# EasyEDA Pro project ProPrj_SRC_Robot2025_V1.0_2026-09-06.epro, schematic Schematic-POWBRD
Board Name: Power_Board; Create Date: 2025-11-13; Page Name: P1; Project Name: SRC_Robot2025_V1.0; Schematic Name: Schematic-POWBRD; Update Date: 2025-11-13; Company: 嘉立创EDA; Page Size: A4; Version: V1.0
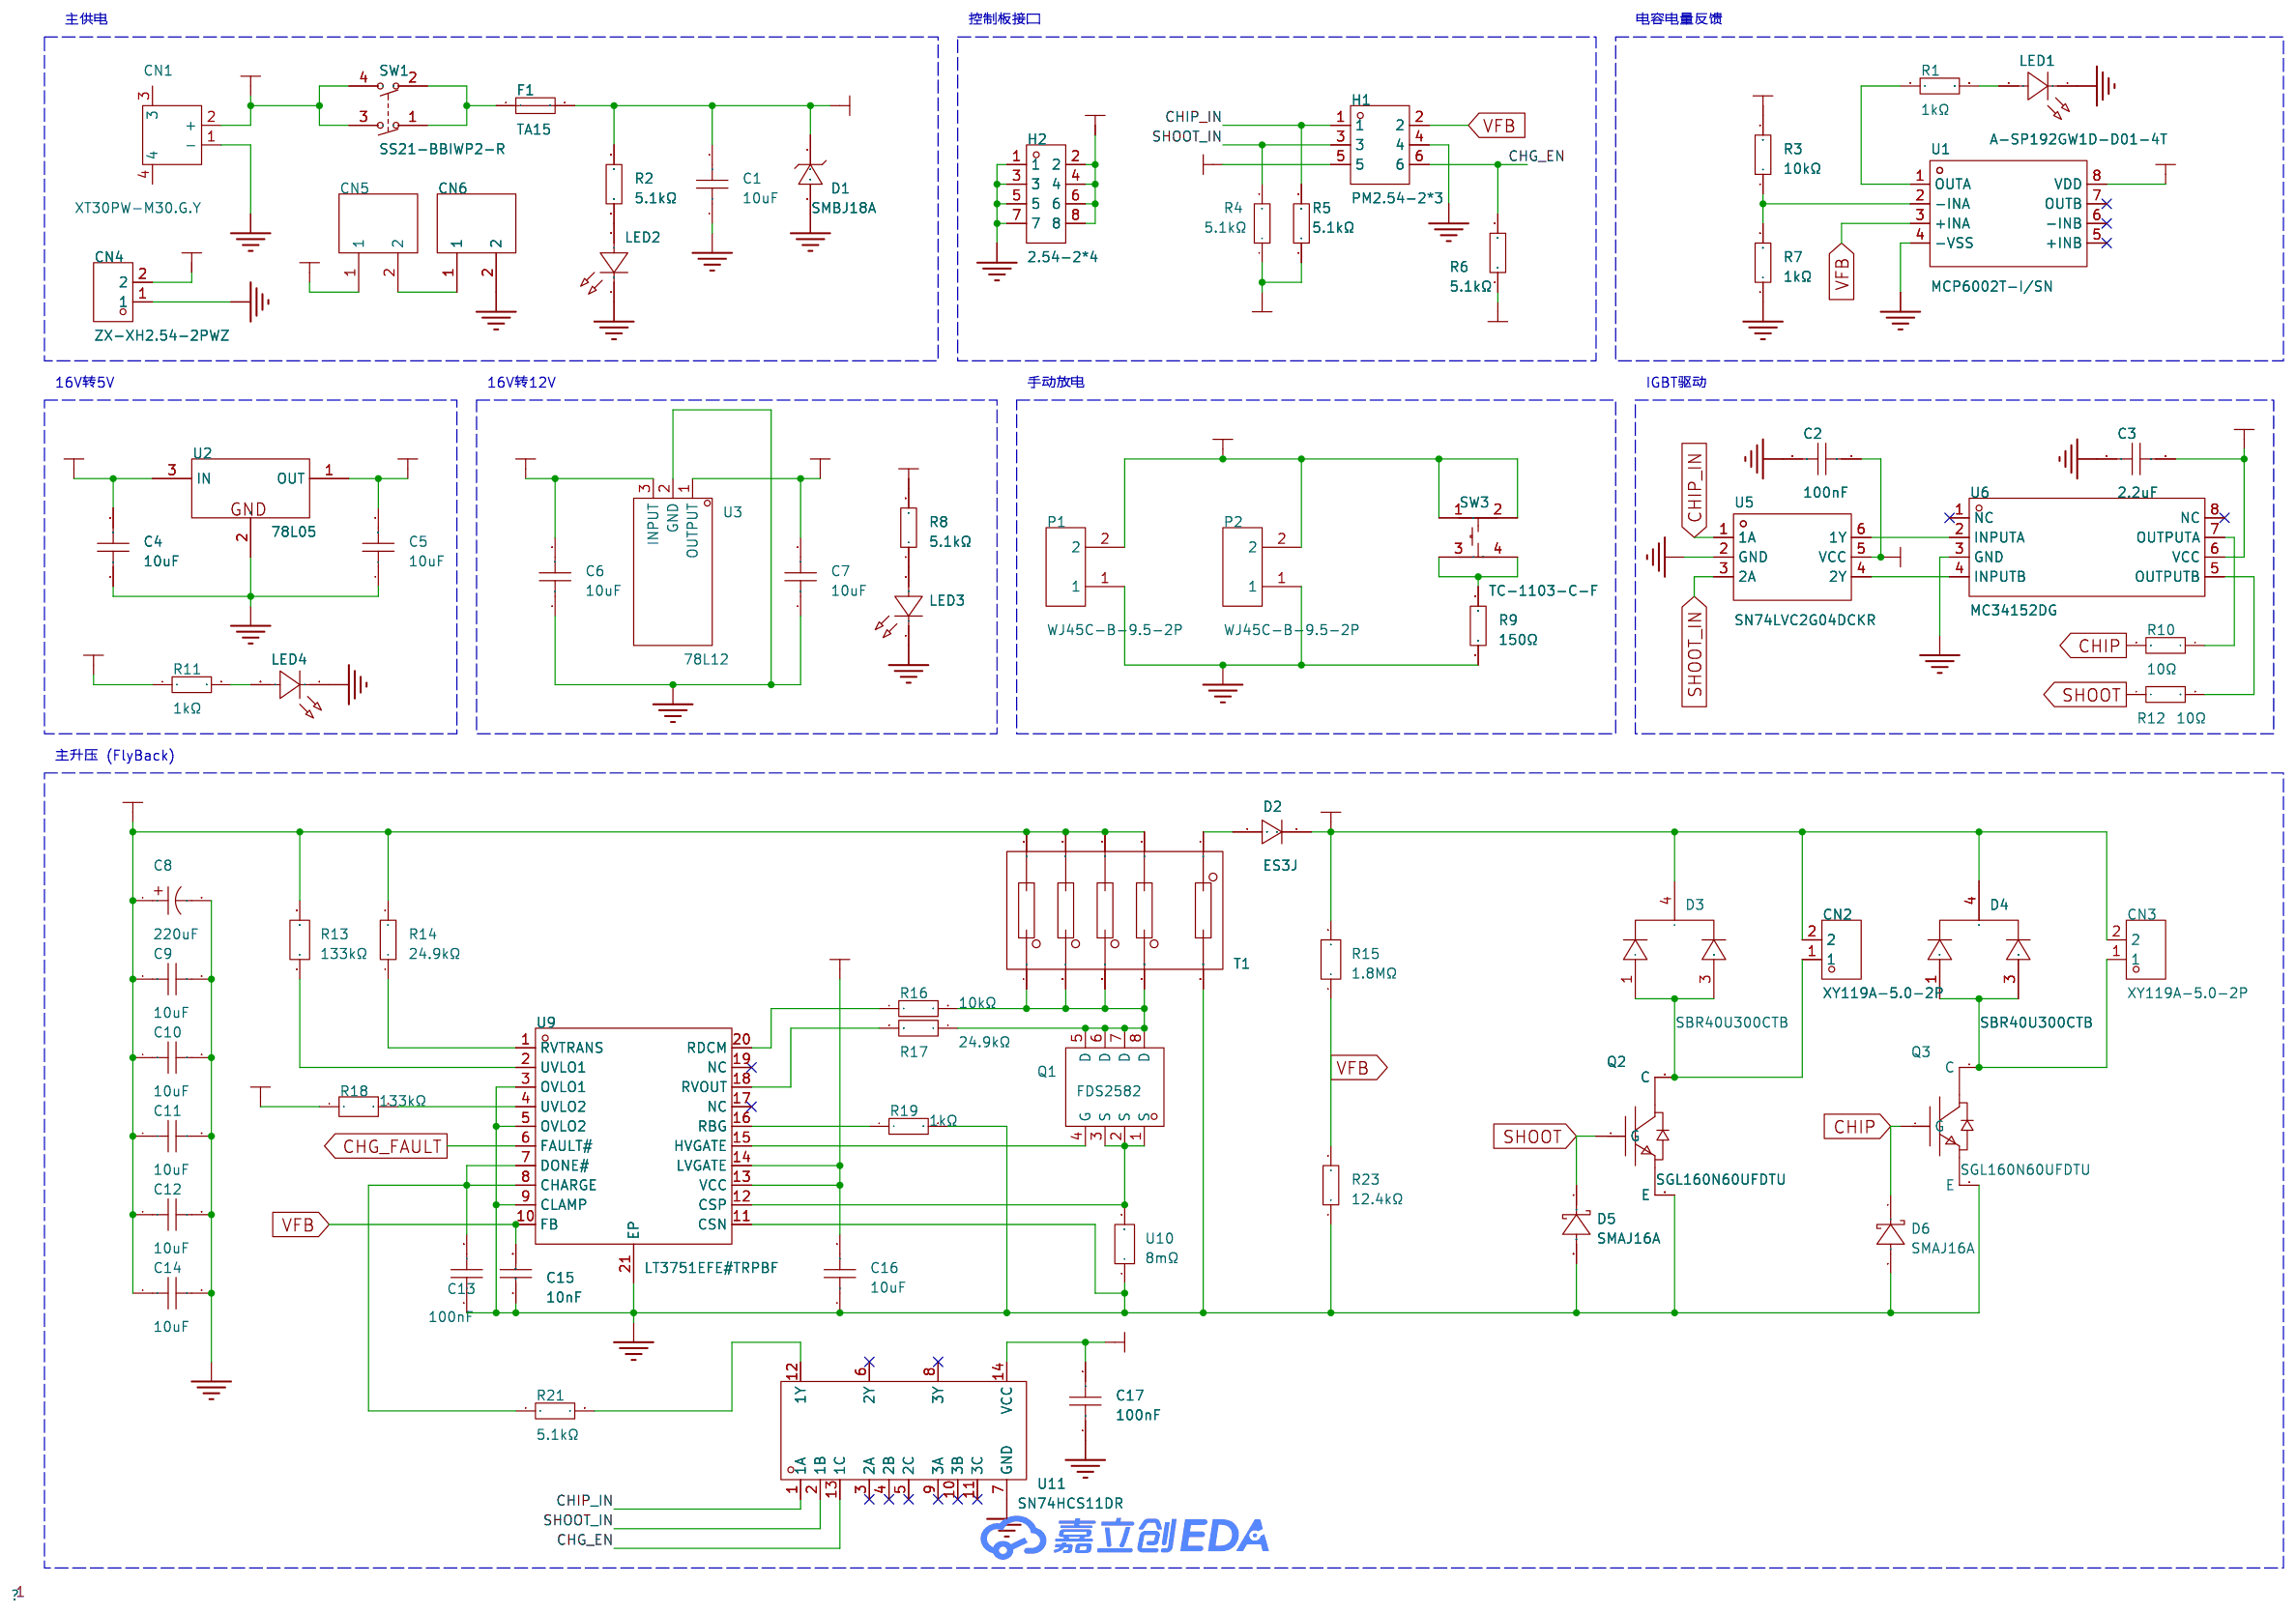
[diagram p10: schematic sheet]

## Parts
C1  10uF  [C0805]
C2  100nF  [C0603]
C3  2.2uF  [C0603]
C4  10uF  [C0805]
C5  10uF  [C0805]
C6  10uF  [C0805]
C7  10uF  [C0805]
C8  220uF  [CAP-SMD_BD6.3-L6.6-W6.6-LS7.4-FD]
C9  10uF  [C1210]
C10  10uF  [C1210]
C11  10uF  [C1210]
C12  10uF  [C1210]
C13  100nF  [C0603]
C14  10uF  [C1210]
C15  10nF  [C0603]
C16  10uF  [C0603]
C17  100nF  [C0603]
CN1  XT30PW-M30.G.Y  [CONN-TH_XT30PW-M]
CN2  XY119A-5.0-2P  [CONN-TH_XY119A-5.0-2P]
CN3  XY119A-5.0-2P  [CONN-TH_XY119A-5.0-2P]
CN4  ZX-XH2.54-2PWZ  [CONN-TH_2P-P2.50_ZX-XH2.54-2PWZ]
CN5  AM-1015B-M  [CONN-TH_AM-1015B-M]
CN6  AM-1015B-M  [CONN-TH_AM-1015B-M]
D1  SMBJ18A  [SMB_L4.4-W3.6-LS5.3-RD]
D2  ES3J  [SMC_L6.9-W5.9-LS7.9-RD]
D3  SBR40U300CTB  [D2PAK_L9.1-W10.0-P2.54-LS15.3-BR]
D4  SBR40U300CTB  [D2PAK_L9.1-W10.0-P2.54-LS15.3-BR]
D5  SMAJ16A  [SMA_L4.3-W2.6-LS5.0-RD]
D6  SMAJ16A  [SMA_L4.3-W2.6-LS5.0-RD]
F1  TA15  [F2410]
H1  PM2.54-2*3  [HDR-TH_6P-P2.54-V-F-R2-C3-S2.54]
H2  2.54-2*4  [HDR-TH_8P-P2.54-V-F-R2-C4-S2.54]
LED1  A-SP192GW1D-D01-4T  [LED0603-RD]
LED2  A-SP192GW1D-D01-4T  [LED0603-RD]
LED3  A-SP192GW1D-D01-4T  [LED0603-RD]
LED4  A-SP192GW1D-D01-4T  [LED0603-RD]
P1  WJ45C-B-9.5-2P  [CONN-TH_2P-P9.50_WJ45C-B-2P]
P2  WJ45C-B-9.5-2P  [CONN-TH_2P-P9.50_WJ45C-B-2P]
Q1  FDS2582  [SO-8_L4.9-W3.9-P1.27-LS6.0-BL]
Q2  SGL160N60UFDTU  [TO-264-3_L20.0-W5.0-P5.45-L]
Q3  SGL160N60UFDTU  [TO-264-3_L20.0-W5.0-P5.45-L]
R1  1kΩ  [R0603]
R2  5.1kΩ  [R0603]
R3  10kΩ  [R0603]
R4  5.1kΩ  [R0805]
R5  5.1kΩ  [R0805]
R6  5.1kΩ  [R0805]
R7  1kΩ  [R0603]
R8  5.1kΩ  [R0603]
R9  150Ω  [RES-TH_BD9.5-L22.0-P26.00-D0.7]
R10  10Ω  [R0603]
R11  1kΩ  [R0603]
R12  10Ω  [R0603]
R13  133kΩ  [R0603]
R14  24.9kΩ  [R0603]
R15  1.8MΩ  [R1210]
R16  10kΩ  [R0603]
R17  24.9kΩ  [R0603]
R18  133kΩ  [R0603]
R19  1kΩ  [R0603]
R21  5.1kΩ  [R0603]
R23  12.4kΩ  [R0603]
SW1  SS21-BBIWP2-R  [SW-TH_SS21-BBIWP2]
SW3  TC-1103-C-F  [SW-TH_4P-L12.0-W12.0-P5.00-LS12.5]
T1  -  [DA2034-AL]
U1  MCP6002T-I/SN  [SOIC-8_L4.9-W3.9-P1.27-LS6.0-BL]
U2  78L05  [SOT-89-3_L4.5-W2.5-P1.50-LS4.2-BR]
U3  78L12  [SOT-89-3_L4.5-W2.5-P1.50-LS4.2-BR]
U5  SN74LVC2G04DCKR  [SOT-363_L2.0-W1.3-P0.65-LS2.1-BR]
U6  MC34152DG  [SOIC-8_L5.0-W4.0-P1.27-LS6.0-BL]
U9  LT3751EFE#TRPBF  [TSSOP-20_L6.5-W4.4-P0.65-LS6.4-BL-EP-3]
U10  8mΩ  [R1206]
U11  SN74HCS11DR  [SOIC-14_L8.6-W3.9-P1.27-LS6.0-BL]

## Library data of the parts
C1 C4-C7 = CL21A106KAYNNNE_C15850: 容值:10uF;精度:±10%;额定电压:25V;材质(温度系数):X5R;; LCSC Part Name: 10uF ±10% 25V; Supplier Part: C15850; Manufacturer: SAMSUNG(三星); Manufacturer Part: CL21A106KAYNNNE; Supplier Footprint: 0805; JLCPCB Part Class: 基础库; Datasheet: https://atta.szlcsc.com/upload/public/pdf/source/20160218/1457707763339.pdf; Supplier: LCSC; Tolerance: ±10%; Voltage Rated: 25V; Temperature Coefficient: X5R
C2 C13 C17 = CGA0603X7R104K500JT: 容值:100nF;精度:±10%;额定电压:50V;材质(温度系数):X7R;; LCSC Part Name: 100nF ±10% 50V; Supplier Part: C6119867; Manufacturer: HRE(芯声); Supplier Footprint: 0603; JLCPCB Part Class: 扩展库; Supplier: LCSC; Tolerance: ±10%; Voltage Rated: 50V; Temperature Coefficient: X7R
C3 = CL10A225KB8NNNC: 容值:2.2uF;精度:±10%;额定电压:50V;材质(温度系数):X5R;; LCSC Part Name: 2.2uF ±10% 50V; Supplier Part: C913904; Manufacturer: SAMSUNG(三星); Supplier Footprint: 0603; JLCPCB Part Class: 扩展库; Datasheet: https://atta.szlcsc.com/upload/public/pdf/source/20160218/1457707763339.pdf; Supplier: LCSC; Tolerance: ±10%; Voltage Rated: 50V; Temperature Coefficient: X5R
C8 = RVT1E221M0607: 容值:220uF;精度:±20%;额定电压:25V;纹波电流:150mA@120Hz;等效串联电阻:-;; LCSC Part Name: 220uF ±20% 25V; Supplier Part: C2918361; Manufacturer: ROQANG(容强); Supplier Footprint: SMD,D6.3xL7.7mm; JLCPCB Part Class: 扩展库; Datasheet: https://atta.szlcsc.com/upload/public/pdf/source/20211118/497C0614266278696CA52BDF245B991F.pdf; Supplier: LCSC; Tolerance: ±20%; Rated Voltage: 25V; Ripple Current: 150mA@120Hz; φD: 6.3mm; L: 7.7mm; Lifetime @ Temp: 2000hrs@105℃; Operating Temperature: -40℃~+105℃
C9-C12 C14 = FS32X106K101EGG: 容值:10uF;精度:±10%;额定电压:100V;材质(温度系数):X7R;; LCSC Part Name: 10uF ±10% 100V; Supplier Part: C5156756; Manufacturer: PSA(信昌电陶); Supplier Footprint: 1210; JLCPCB Part Class: 扩展库; Datasheet: https://atta.szlcsc.com/upload/public/pdf/source/20220906/2A42A90825742552985FFB5A7BAB200E.pdf; Supplier: LCSC; Tolerance: ±10%; Voltage Rated: 100V; Temperature Coefficient: X7R
C15 = CC0603KRX7R9BB103: 容值:10nF;精度:±10%;额定电压:50V;材质(温度系数):X7R;; LCSC Part Name: 10nF ±10% 50V; Supplier Part: C100042; Manufacturer: YAGEO(国巨); Supplier Footprint: 0603; JLCPCB Part Class: 扩展库; Datasheet: https://atta.szlcsc.com/upload/public/pdf/source/20181008/C309510_22F155564471FAF6A489F7D68F34234E.pdf; Supplier: LCSC; Tolerance: ±10%; Voltage Rated: 50V; Temperature Coefficient: X7R
C16 = CGA0603X5R106K100JT: 容值:10uF;精度:±10%;额定电压:10V;材质(温度系数):X5R;; LCSC Part Name: 10uF ±10% 10V; Supplier Part: C6119842; Manufacturer: HRE(芯声); Supplier Footprint: 0603; JLCPCB Part Class: 扩展库; Supplier: LCSC; Tolerance: ±10%; Voltage Rated: 10V; Temperature Coefficient: X5R
CN1 = XT30PW-M30.G.Y: 类别:-;类型1:-;; LCSC Part Name: AMASS(艾迈斯)航模插头 卧式弯脚 XT30PW-M公头; Supplier Part: C431092; Manufacturer: AMASS(艾迈斯); JLCPCB Part Class: 扩展库; Datasheet: https://atta.szlcsc.com/upload/public/pdf/source/20220222/6A9F22F7850E25B33E1BE430ADF8560B.pdf; Supplier: LCSC; Type: 航模插头; RatedVoltage: DC 500V; InterfaceType: 公头; RatedCurrent: 15A; RecommendedWireGauge: 16/18/20AWG; contact resistance: 1.2mΩ; specifications: 2pin
CN2 CN3 = XY119A-5.0-2P: 结构:1x2P;间距:5mm;颜色:灰色;安装类型:-;总PIN数:2P;每排PIN数:2;额定电流:5A;额定电压:300V;线规 - AWG:18~20;线规 - 平方毫米:1.5;工作温度范围:-;排数:1;; LCSC Part Name: 1x2P 5mm 每排P数:2 排数:1; Supplier Part: C784939; Manufacturer: XINLAIYA(新莱亚); Supplier Footprint: 插件,P=5mm; JLCPCB Part Class: 扩展库; Datasheet: https://atta.szlcsc.com/upload/public/pdf/source/20200917/C784939_AFEB00D015492A69142AB4BCD44AD19C.pdf; Supplier: LCSC; Structure: 1x2P; Pitch: 5mm; Color: 灰色; Number of Pins: 2P; Number of PINs Per Row: 2; Current Rating (Max): 5A; Voltage Rating (Max): 300V; Wire Gauge - AWG: 18~20; Wire Gauge - mm2: 1.5; Number of Rows: 1
CN4 = ZX-XH2.54-2PWZ: 插针结构:1x2P;间距:2.5mm;安装方式:弯插;参考系列:XH;总PIN数:2P;排数:1;每排PIN数:2;行距:-;额定电流:3A;触头材质:黄铜;触头镀层:锡;工作温度范围:-25℃~+85℃;; LCSC Part Name: 1x2P 间距:2.5mm 弯插 系列:XH; Supplier Part: C7429641; Manufacturer: Megastar(兆星); Supplier Footprint: 弯插,P=2.5mm; JLCPCB Part Class: 扩展库; Datasheet: https://atta.szlcsc.com/upload/public/pdf/source/20230619/56AE8F2E01CDFEAA97FC89B5ED558AB5.pdf; Supplier: LCSC; Pins Structure: 1x2P; Pitch: 2.5mm; Mounting Type: 弯插; Reference Series: XH; Number of Pins: 2P; Number of Rows: 1; Number of PINs Per Row: 2; Rated Current: 3A; Contact Material: 黄铜; Contact Plating: 锡; Operating Temperature: -25℃~+85℃; Rated Voltage (Max): 250V; Plastic Material: PA66; Flame Retardant Rating: UL94V-0; Color: 白色; Z-Height of the Board: 5.9mm; X-Length of Bottom Edge on Board (Spacing Line): 7.5mm; Y-Width of Bottom Edge on Board: 7.32mm
CN5 CN6 = AM-1015B-M: 类别:-;类型1:-;; LCSC Part Name: AMASS(艾迈斯)电源连接器公头AM-1015B-M; Supplier Part: C90631; Manufacturer: AMASS(艾迈斯); JLCPCB Part Class: 扩展库; Datasheet: https://atta.szlcsc.com/upload/public/pdf/source/20161217/1481939174683.pdf; Supplier: LCSC; Brand: 艾迈斯; Type: T行插头; RatedVoltage: DC 500V; InterfaceType: 双公头; MetalMaterial: 铜镀金; InsulationMaterial: PA; RatedCurrent: 25A; RecommendedWireGauge: 12AWG; FlameRetardantGrade: UL94 V0; contact resistance: 0.45mΩ
D1 = SMBJ18A_C726827: 极性：单向 反向截止电压(Vrwm)：18V 击穿电压：20V 最大钳位电压：29.2V; Supplier Part: C726827; Manufacturer: TWGMC(台湾迪嘉); Supplier Footprint: SMB; JLCPCB Part Class: 扩展库; Datasheet: https://atta.szlcsc.com/upload/public/pdf/source/20200901/C726811_07201DC3516E92FF13903A0BAE18F725.pdf; Supplier: LCSC
D2 = ES3J_C241736: 二极管配置:-;正向压降(Vf):1.7V@3A;直流反向耐压(Vr):600V;平均整流电流(Io):3A;; LCSC Part Name: 电压:600V 电流:3A; Supplier Part: C241736; Manufacturer: onsemi(安森美); Supplier Footprint: SMC(DO-214AB); JLCPCB Part Class: 扩展库; Datasheet: https://atta.szlcsc.com/upload/public/pdf/source/20181011/C241736_92143A5DE005FA7AD96EC325CCC50FD0.pdf; Supplier: LCSC; Forward Voltage (Vf@If): 1.7V@3A; Reverse Voltage (Vr): 600V; Average Rectified Current (Io): 3A; Reverse Leakage Current: 10uA@600V
D3 D4 = SBR40U300CTB: 二极管配置:1对共阴极;正向压降(Vf):870mV@20A;直流反向耐压(Vr):300V;整流电流:20A;; LCSC Part Name: 电压:300V 电流:20A; Supplier Part: C443663; Manufacturer: DIODES(美台); Supplier Footprint: D2PAK; JLCPCB Part Class: 扩展库; Datasheet: https://atta.szlcsc.com/upload/public/pdf/source/20191127/C460254_D77CF0DA5F9C5BCD250C1885B666AA89.pdf; Supplier: LCSC; Diode Configuration: 1对共阴极; Forward Voltage (Vf) @ If: 870mV@20A; Reverse Voltage (Vr): 300V; Rectified Current: 20A; Reverse Leakage Current: 100uA@300V
D5 D6 = SMAJ16A_C908770: 反向截止电压(Vrwm):16V;最大钳位电压:26V;峰值脉冲电流(Ipp)@10/1000us:15.3A;击穿电压:17.8V;; LCSC Part Name: 单向TVS 16V截止 15.3A峰值脉冲; Supplier Part: C908770; Manufacturer: GOODWORK(固得沃克); Supplier Footprint: SMA(DO-214AC); JLCPCB Part Class: 扩展库; Datasheet: https://atta.szlcsc.com/upload/public/pdf/source/20201231/C908757_5436EAF671B686EFC2F0DD2098F0ED89.pdf; Supplier: LCSC; Reverse Stand-Off Voltage (Vrwm): 16V; Maximum Clamping Voltage: 26V; Peak Pulse Current (Ipp)@10/1000us: 15.3A; Breakdown Voltage: 17.8V; Reverse Leakage Current (Ir): 5uA; Type: TVS
F1 = TA15: LCSC Part Name: 2410慢断 15A 125V 镀金; Supplier Part: C3014141; Manufacturer: TLC(竞沃); Supplier Footprint: 2410; JLCPCB Part Class: 扩展库; Datasheet: https://atta.szlcsc.com/upload/public/pdf/source/20220520/C6351CD6C5E279D329958371DE6E5323.pdf; Supplier: LCSC
H1 = PM2.54-2*3: 插孔结构:2x3P;间距:2.54mm;行距:2.54mm;圆孔/方孔:方孔;安装类型:直插;排数:双排;总孔位数:6P;额定电流:2.5A;插孔方向:顶部;塑高:8.5mm;工作温度范围:-40℃~+105℃;; LCSC Part Name: 间距:2.54mm 2x3P 直插; Supplier Part: C5116527; Manufacturer: ZHOURI(洲日); Supplier Footprint: 插件,P=2.54mm; JLCPCB Part Class: 扩展库; Datasheet: https://atta.szlcsc.com/upload/public/pdf/source/20220729/B685A447B6E7D9EA1A3EF6B07540DD20.pdf; Supplier: LCSC; Holes Structure: 2x3P; Pitch: 2.54mm; Row Spacing: 2.54mm; Circular Hole / Square Hole: 方孔; Mounting Type: 直插; Number of Rows: 双排; Number of Holes: 6P; Current Rating (Max): 2.5A; Holes Direction: 顶部; Insulation Height: 8.5mm; Operating Temperature Range: -40℃~+105℃
H2 = 2.54-2*4: 插孔结构:2x4P;间距:2.54mm;行距:2.54mm;圆孔/方孔:方孔;安装类型:直插;排数:双排;总孔位数:8P;额定电流:2.5A;额定电压:-;插孔方向:顶部;塑高:8.5mm;工作温度范围:-40℃~+105℃;; LCSC Part Name: 间距:2.54mm 2x4P 直插; Supplier Part: C2977588; Manufacturer: ZHOURI(洲日); Supplier Footprint: 插件,P=2.54mm; JLCPCB Part Class: 扩展库; Datasheet: https://atta.szlcsc.com/upload/public/pdf/source/20220328/363EB391BC0EB759CF231FC910753CBE.pdf; Supplier: LCSC; Holes Structure: 2x4P; Pitch: 2.54mm; Row Spacing: 2.54mm; Circular Hole / Square Hole: 方孔; Mounting Type: 直插; Number of Rows: 双排; Number of Holes: 8P; Current Rating (Max): 2.5A; Holes Direction: 顶部; Insulation Height: 8.5mm; Operating Temperature Range: -40℃~+105℃
LED1-LED4 = A-SP192GW1D-D01-4T: 发光颜色:白色;正向压降(Vf):2.5V~2.9V;功率:95mW;透镜颜色:-;发光强度:57mcd~225mcd;发光角度:130°;载带方式:正贴;工作温度:-40℃~+85℃;; LCSC Part Name: 0603白光正贴（正白偏冷）; Supplier Part: C19171285; Manufacturer: Amicc(欧密格光电); Supplier Footprint: 0603; JLCPCB Part Class: 扩展库; Datasheet: https://atta.szlcsc.com/upload/public/pdf/source/20231108/C509B7BEC9EA0B1CC79F1E6D714E882A.pdf; Supplier: LCSC; Illumination Color: 白色; Voltage - Forward(Vf): 2.5V~2.9V; Power(Watts): 95mW; Luminous Intensity: 57mcd~225mcd; Viewing Angle: 130°; Mounting Sytle: 正贴; Operating Temperature: -40℃~+85℃
P1 P2 = WJ45C-B-9.5-2P: 隔板类型:两面;间距:9.5mm;结构:1x2P;安装方式:直针;引脚位置:中脚;排数:1;额定电流:32A;额定电压:750V;线规 - AWG:12~22;线规 - 平方毫米:4;工作温度范围:-40℃~+105℃;颜色:黑色;每排PIN数:2;; LCSC Part Name: 9.5mm 1x2P 每排P数:2 排数:1 直针 中脚; Supplier Part: C8397; Manufacturer: KANGNEX(康奈克斯电气); Supplier Footprint: 插件,P=9.5mm; JLCPCB Part Class: 扩展库; Datasheet: https://atta.szlcsc.com/upload/public/pdf/source/20191225/C8397_C0B2C2E73138A510EBF0F13B91F71912.pdf; Supplier: LCSC; Barrier Type: 两面; Pitch: 9.5mm; Structure: 1x2P; Mounting Style: 直针; Pin Location: 中脚; Number of Pins: 2P; Number of Rows: 1; Current Rating (Max): 32A; Voltage Rating (Max): 750V; Wire Gauge - AWG: 12~22; Wire Gauge - mm2: 4; Operating Temperature Range: -40℃~+105℃; Color: 黑色; Number of PINs Per Row: 2
Q1 = FDS2582: 类型:1个N沟道;漏源电压(Vdss):150V;连续漏极电流(Id):4.1A;导通电阻(RDS(on)@Vgs,Id):66mΩ@10V,4.1A;功率(Pd):2.5W;阈值电压(Vgs(th)@Id):2V@250uA;; LCSC Part Name: 1个N沟道 耐压:150V 电流:4.1A; Supplier Part: C455164; Manufacturer: onsemi(安森美); Supplier Footprint: SOIC-8; JLCPCB Part Class: 扩展库; Datasheet: https://atta.szlcsc.com/upload/public/pdf/source/20221020/9C50A917A0E5BABEC1E9E5186C957306.pdf; Supplier: LCSC; Type: 1个N沟道; Drain Source Voltage (Vdss): 150V; Continuous Drain Current (Id): 4.1A; Drain Source On Resistance (RDS(on)@Vgs,Id): 66mΩ@10V,4.1A; Power Dissipation (Pd): 2.5W; Gate Threshold Voltage (Vgs(th)@Id): 2V@250uA; Total Gate Charge (Qg@Vgs): 19nC@10V; Input Capacitance (Ciss@Vds): 1.29nF@25V; Reverse Transfer Capacitance (Crss@Vds): 32pF@25V; Operating Temperature: -55℃~+150℃
Q2 Q3 = SGL160N60UFDTU: IGBT类型:-;集射极击穿电压(Vces):600V;集电极电流(Ic):160A;功率(Pd):250W;; LCSC Part Name: 耐压:600V 电流:160A; Supplier Part: C11757; Manufacturer: onsemi(安森美); Supplier Footprint: TO-264-3; JLCPCB Part Class: 扩展库; Datasheet: https://atta.szlcsc.com/upload/public/pdf/source/20130302/1457706596740.pdf; Supplier: LCSC; Collector-Emitter Breakdown Voltage (Vces): 600V; Collector Current (Ic): 160A; Power Dissipation (Pd): 250W; Pulsed Collector Current (Icm): 300A; Gate-Emitter Threshold Voltage (Vge(th)@Ic): 2.6V@15V,80A; Total Gate Charge (Qg@Ic,Vge): 345nC; Turn?on Delay Time (Td(on)): 40ns; Turn?off Delay Time (Td(off)): 90ns; Turn?on Switching Loss (Eon): 2.5mJ; Turn?off Switching Loss (Eoff): 1.76mJ; Diode Reverse Recovery Time (Trr): 95ns; Operating Temperature: -55℃~+150℃@(Tj)
R1 R7 R11 R19 = 0603WAF1001T5E: 电阻类型:厚膜电阻;阻值:1kΩ;精度:±1%;功率:100mW;最大工作电压:75V;温度系数:±100ppm/℃;; LCSC Part Name: 1kΩ ±1% 100mW 厚膜电阻; Supplier Part: C21190; Manufacturer: UNI-ROYAL(厚声); Supplier Footprint: 0603; JLCPCB Part Class: 基础库; Datasheet: https://atta.szlcsc.com/upload/public/pdf/source/20200306/C422600_1E6D84923E4A46A82E41ADD87F860B5C.pdf; Supplier: LCSC; Type: 厚膜电阻; Tolerance: ±1%; Power(Watts): 100mW; Overload Voltage (Max): 75V; Temperature Coefficient: ±100ppm/℃; Operating Temperature Range: -55℃~+155℃
R2 R8 R21 = 0603WAF5101T5E: 电阻类型:厚膜电阻;阻值:5.1kΩ;精度:±1%;功率:100mW;最大工作电压:75V;温度系数:±100ppm/℃;; LCSC Part Name: 5.1kΩ ±1% 100mW 厚膜电阻; Supplier Part: C23186; Manufacturer: UNI-ROYAL(厚声); Supplier Footprint: 0603; JLCPCB Part Class: 基础库; Datasheet: https://atta.szlcsc.com/upload/public/pdf/source/20200306/C422600_1E6D84923E4A46A82E41ADD87F860B5C.pdf; Supplier: LCSC; Type: 厚膜电阻; Tolerance: ±1%; Power(Watts): 100mW; Overload Voltage (Max): 75V; Temperature Coefficient: ±100ppm/℃; Operating Temperature Range: -55℃~+155℃
R3 R16 = 0603WAF1002T5E: 电阻类型:厚膜电阻;阻值:10kΩ;精度:±1%;功率:100mW;最大工作电压:75V;温度系数:±100ppm/℃;; LCSC Part Name: 厚膜电阻 10kΩ ±1% 100mW; Supplier Part: C25804; Manufacturer: UNI-ROYAL(厚声); Supplier Footprint: 0603; JLCPCB Part Class: 基础库; Datasheet: https://atta.szlcsc.com/upload/public/pdf/source/20200306/C422600_1E6D84923E4A46A82E41ADD87F860B5C.pdf; Supplier: LCSC; Type: 厚膜电阻; Tolerance: ±1%; Power(Watts): 100mW; Overload Voltage (Max): 75V; Temperature Coefficient: ±100ppm/℃; Operating Temperature Range: -55℃~+155℃
R4-R6 = 0805W8F5101T5E: 电阻类型:厚膜电阻;阻值:5.1kΩ;精度:±1%;功率:125mW;最大工作电压:150V;温度系数:±100ppm/℃;; LCSC Part Name: 5.1kΩ ±1% 125mW 厚膜电阻; Supplier Part: C27834; Manufacturer: UNI-ROYAL(厚声); Supplier Footprint: 0805; JLCPCB Part Class: 基础库; Datasheet: https://atta.szlcsc.com/upload/public/pdf/source/20200306/C422600_1E6D84923E4A46A82E41ADD87F860B5C.pdf; Supplier: LCSC; Type: 厚膜电阻; Tolerance: ±1%; Power(Watts): 125mW; Overload Voltage (Max): 150V; Temperature Coefficient: ±100ppm/℃; Operating Temperature Range: -55℃~+155℃
R9 = CR-L5W-150Ω 5% P: 电阻类型:水泥电阻;阻值:150Ω;精度:±5%;功率:5W;温度系数:±350ppm/℃;; LCSC Part Name: 水泥电阻 150Ω ±5% 5W; Supplier Part: C334292; Manufacturer: CCO(千志电子); Supplier Footprint: 插件,22x9.5mm; JLCPCB Part Class: 扩展库; Datasheet: https://atta.szlcsc.com/upload/public/pdf/source/20191017/C437676_C54E3679BC570A0C77C1700A5DFC89CF.pdf; Supplier: LCSC; Type: 水泥电阻; Tolerance: ±5%; Overload Voltage (Max): 750V; Power(Watts): 5W; Temperature Coefficient: ±350ppm/℃; Operating Temperature Range: -55℃~+250℃
R10 R12 = 0603WAF100JT5E: 电阻类型:厚膜电阻;阻值:10Ω;精度:±1%;功率:100mW;最大工作电压:75V;温度系数:±400ppm/℃;; LCSC Part Name: 10Ω ±1% 100mW 厚膜电阻; Supplier Part: C22859; Manufacturer: UNI-ROYAL(厚声); Supplier Footprint: 0603; JLCPCB Part Class: 基础库; Datasheet: https://atta.szlcsc.com/upload/public/pdf/source/20200306/C422600_1E6D84923E4A46A82E41ADD87F860B5C.pdf; Supplier: LCSC; Type: 厚膜电阻; Tolerance: ±1%; Power(Watts): 100mW; Overload Voltage (Max): 75V; Temperature Coefficient: ±400ppm/℃; Operating Temperature Range: -55℃~+155℃
R13 R18 = RT0603BRE07133KL: 电阻类型:薄膜电阻;阻值:133kΩ;精度:±0.1%;功率:100mW;温度系数:±50ppm/℃;; LCSC Part Name: 薄膜电阻 133kΩ ±0.1% 100mW; Supplier Part: C861659; Manufacturer: YAGEO(国巨); Supplier Footprint: 0603; JLCPCB Part Class: 扩展库; Datasheet: https://atta.szlcsc.com/upload/public/pdf/source/20200610/C326738_5639A9F1B6EB6E4AE2197577D3456E7F.pdf; Supplier: LCSC; Type: 薄膜电阻; Tolerance: ±0.1%; Power(Watts): 100mW; Temperature Coefficient: ±50ppm/℃; Operating Temperature Range: -55℃~+155℃
R14 R17 = 0603WAF2492T5E: 电阻类型:厚膜电阻;阻值:24.9kΩ;精度:±1%;功率:100mW;最大工作电压:75V;温度系数:±100ppm/℃;; LCSC Part Name: 24.9kΩ ±1% 100mW 厚膜电阻; Supplier Part: C25962; Manufacturer: UNI-ROYAL(厚声); Supplier Footprint: 0603; JLCPCB Part Class: 扩展库; Datasheet: https://atta.szlcsc.com/upload/public/pdf/source/20200306/C422600_1E6D84923E4A46A82E41ADD87F860B5C.pdf; Supplier: LCSC; Type: 厚膜电阻; Tolerance: ±1%; Power(Watts): 100mW; Overload Voltage (Max): 75V; Temperature Coefficient: ±100ppm/℃; Operating Temperature Range: -55℃~+155℃
R15 = AC1210JR-071M8L: 电阻类型:厚膜电阻;阻值:1.8MΩ;精度:±5%;功率:500mW;最大工作电压:200V;温度系数:±100ppm/℃;; LCSC Part Name: 厚膜电阻 1.8MΩ ±5% 500mW; Supplier Part: C728057; Manufacturer: YAGEO(国巨); Supplier Footprint: 1210; JLCPCB Part Class: 扩展库; Datasheet: https://atta.szlcsc.com/upload/public/pdf/source/20200821/C727952_41DBFD40DC9019BCD03635260E40DDDE.pdf; Supplier: LCSC; Type: 厚膜电阻; Tolerance: ±5%; Power(Watts): 500mW; Overload Voltage (Max): 200V; Temperature Coefficient: ±100ppm/℃; Operating Temperature Range: -55℃~+155℃
R23 = 0603WAF1242T5E: 电阻类型:厚膜电阻;阻值:12.4kΩ;精度:±1%;功率:100mW;工作电压:75V;温度系数:±100ppm/℃;; LCSC Part Name: 12.4kΩ ±1% 100mW 厚膜电阻; Supplier Part: C22865; Manufacturer: UNI-ROYAL(厚声); Supplier Footprint: 0603; JLCPCB Part Class: 扩展库; Datasheet: https://item.szlcsc.com/datasheet/0603WAF1242T5E/23592.html; Supplier: LCSC; Type: 厚膜电阻; Tolerance: ±1%; Power(Watts): 100mW; Voltage-Supply(Max): 75V; Temperature Coefficient: ±100ppm/℃; Operating Temperature: -55℃~+155℃
SW1 = SS21-BBIWP2-R: 带灯:-;引脚样式:焊片;额定电流:10A;额定电压(AC):250V;额定电压(DC):-;电路结构:双刀单掷;机械寿命:-;; LCSC Part Name: 跷板开关DPST 15x21mm; Supplier Part: C309182; Manufacturer: Legion(六钧); Supplier Footprint: 插件; JLCPCB Part Class: 扩展库; Datasheet: https://atta.szlcsc.com/upload/public/pdf/source/20190311/C309182_BE3155CDE2291F8D537E9264D9294CC5.pdf; Supplier: LCSC; Actuator Type: 凹面弯曲; Pin Style: 焊片; Actuator Color: 黑色; Contact Current: 10A; Voltage Rating (AC): 250V; Circuit: 双刀单掷; Actuator Identifier: - O
SW3 = TC-1103-C-F: 电路结构:单刀单掷;按钮形状:圆形按钮;作用力:260gf;安装方式:直插;开关长度:12mm;开关宽度:12mm;开关高度:6.5mm;带支架:不带;触点电流:50mA;额定电压(DC):12V;绝缘电阻:-;带灯:无;机械寿命:10万次;; LCSC Part Name: 12*12*6.5mm 直插 轻触开关; Supplier Part: C561464; Manufacturer: XKB Connectivity(中国星坤); Supplier Footprint: 插件; JLCPCB Part Class: 扩展库; Datasheet: https://atta.szlcsc.com/upload/public/pdf/source/20211011/68D1180622A7471600864EE2962EC968.pdf; Supplier: LCSC; Circuit: 单刀单掷; Actuator Style: 圆形按钮; Operating Force: 260gf; Mounting Style: 直插; Switch Length: 12mm; Switch Width: 12mm; Switch Height: 6.5mm; Strike Gundam: 不带; Contact Current: 50mA; Voltage Rating (DC): 12V; Actuator/Cap Color: 黑色; With Lamp: 无; Pin Style: PC引脚; Mechanical Life: 10万次; Operating Temperature: -30℃~+85℃
T1 = DA2034-AL: 变压器
U1 = MCP6002T-I/SN: 放大器数:双路;轨到轨:轨到轨输入,轨到轨输出;增益带宽积(GBP):1MHz;输入失调电压(Vos):4.5mV;压摆率(SR):0.6V/us;输入偏置电流(Ib):1pA;; Supplier Part: C7377; Manufacturer: MICROCHIP(美国微芯); Supplier Footprint: SOIC-8; JLCPCB Part Class: 扩展库; Datasheet: https://atta.szlcsc.com/upload/public/pdf/source/20180629/C185041_C55B4C85D5111611539E93F28BD05430.pdf; Supplier: LCSC; Number of Circuits: 双路; Maximum Power Supply Range (Vdd-Vss): 6V; Rail to Rail: 轨到轨输入,轨到轨输出; Gain Bandwidth Product(GBP): 1MHz; Voltage - Input Offset(Vos): 4.5mV; Input Offset Voltage Drift (Vos TC): 2uV/℃; Slew Rate(SR): 0.6V/us; Current - Input Bias(Ib): 1pA; Noise density(eN): 28nV/√Hz@1kHz; Common Mode Rejection Ratio (CMRR): 76dB; Quiescent Current: 100uA; Output Current: 23mA; Operating Temperature: -40℃~+85℃
U2 = 78L05_C347258: 输出类型:固定;最大输入电压:30V;输出电压:5V;输出电流:100mA;电源纹波抑制比(PSRR):49dB@(120Hz);输出极性:正极;; LCSC Part Name: 输入30V 输出5V 100mA; Supplier Part: C347258; Manufacturer: UMW(友台半导体); Supplier Footprint: SOT-89-3; JLCPCB Part Class: 扩展库; Datasheet: https://atta.szlcsc.com/upload/public/pdf/source/20231109/E3DE607B64FB2BED1580456949804217.pdf; Supplier: LCSC; Output Type: 固定; Maximum Input Voltage: 30V; Output Voltage: 5V; Output Current: 100mA; Power Supply Rejection Ratio (PSRR): 49dB@(120Hz); Dropout Voltage: 1.7V@(40mA); standby current: 5.5mA; Feature: 短路保护；热保护(TSD)；过流保护(OCP); Operating Temperature: -20℃~+120℃@(Tj); Output Polarity: 正极; Number of Outputs: 1
U3 = 78L12_C347272: 输出类型:固定;最大输入电压:35V;输出电压:12V;输出电流:150mA;电源纹波抑制比(PSRR):42dB@(120Hz);输出极性:正极;; LCSC Part Name: 输入35V 输出12V 150mA; Supplier Part: C347272; Manufacturer: UMW(友台半导体); Supplier Footprint: SOT-89-3; JLCPCB Part Class: 扩展库; Datasheet: https://atta.szlcsc.com/upload/public/pdf/source/20231109/E3DE607B64FB2BED1580456949804217.pdf; Supplier: LCSC; Output Type: 固定; Maximum Input Voltage: 35V; Output Voltage: 12V; Output Current: 150mA; Power Supply Rejection Ratio (PSRR): 42dB@(120Hz); Dropout Voltage: 1.7V@(40mA); Feature: 过流保护(OCP)；短路保护；热保护(TSD); Output Polarity: 正极; Number of Outputs: 1
U5 = SN74LVC2G04DCKR: 输入类型:-;电源电压:1.65V~5.5V;供电电流(最大值):10uA;电路数:2;最大传播延迟(tpd):3.2ns@5V,50pF;; LCSC Part Name: 双路反相器; Supplier Part: C105251; Manufacturer: TI(德州仪器); Supplier Footprint: SOT-363-6; JLCPCB Part Class: 扩展库; Datasheet: https://www.ti.com/cn/lit/gpn/sn74lvc2g04; Supplier: LCSC; Supply Voltage(Single): 1.65V~5.5V; Supply Current (Max): 10uA; Number of Circuits: 2; Number of Inputs: 2; Sink Current: 32mA; Source Current: 32mA; High level range (VIH): 1.7V~2V; Low level range (VIL): 700mV~800mV; Max Propagation Delay: 3.2ns@5V,50pF; Series: 74LVC系列; Operating Temperature: -40℃~+125℃
U6 = MC34152DG: 驱动配置:低边;负载类型:MOSFET;驱动通道数:2;峰值灌电流:1.5A;峰值拉电流:1.5A;电源电压:6.1V~18V;上升时间:36ns;下降时间:32ns;; Supplier Part: C236137; Manufacturer: onsemi(安森美); Supplier Footprint: SOIC-8; JLCPCB Part Class: 扩展库; Datasheet: https://atta.szlcsc.com/upload/public/pdf/source/20181113/C328029_6274B595CC8D44DB2F75DD6904B15510.pdf; Supplier: LCSC; Driven Configuration: 低边; Load Type: MOSFET; Number of Drivers: 2; Peak Output Current(sink): 1.5A; Peak Output Current(source): 1.5A; Supply Voltage: 6.1V~18V; Rise Time: 36ns; Fall Time: 32ns; Operating Temperature: 0℃~+150℃@(Tj)
U9 = LT3751EFE#TRPBF: Supplier Part: C671369; Manufacturer: ADI(亚德诺); Supplier Footprint: HTSSOP-20-EP; JLCPCB Part Class: 扩展库; Datasheet: https://atta.szlcsc.com/upload/public/pdf/source/20200824/C671372_5D33D53CA9B94280B2375A81C0870F0A.pdf; Supplier: LCSC
U10 = FRM121WFR008TM: 电阻类型:采样电阻;阻值:8mΩ;精度:±1%;功率:1W;温度系数:±50ppm/℃;; LCSC Part Name: 8mΩ ±1% 1W 合金电阻; Supplier Part: C7420012; Manufacturer: FOJAN(富捷); Supplier Footprint: 1206; JLCPCB Part Class: 扩展库; Datasheet: https://atta.szlcsc.com/upload/public/pdf/source/20240709/7FCE84187288C94C67B1004F90EDDF14.pdf; Supplier: LCSC; Type: 采样电阻; Tolerance: ±1%; Power(Watts): 1W; Temperature Coefficient: ±50ppm/℃
U11 = SN74HCS11DR: 逻辑类型:与门;通道数:3;电源电压:2V~6V;静态电流(最大值):2uA;最大传播延迟:16ns@6V,50pF;; Supplier Part: C2869822; Manufacturer: TI(德州仪器); Supplier Footprint: SOIC-14; JLCPCB Part Class: 扩展库; Datasheet: https://www.ti.com/cn/lit/gpn/sn74hcs11; Supplier: LCSC; Logic Gate Type: 与门; Number of Channels: 3; Supply Voltage: 2V~6V; Quiescent Current (Max): 2uA; Sink Current: 7.8mA; Source Current: 7.8mA; High Level Range (VIH): 1.5V~4.2V; Low Level Range (VIL): 1V~3V; Series: 74HCS系列; Propagation Delay Time: 16ns@6V,50pF; Operating Temperature: -40℃~+125℃

## Nets
+5V: C2.1 C5.2 C17.2 H1.5 R3.2 R4.1 R5.1 R6.1 R11.1 U1.8(VDD) U2.1(OUT) U5.5(VCC) U11.14(VCC)
+12V: C7.2 C16.2 R8.2 R18.1 U3.1(OUTPUT) U9.13(VCC) U9.14(LVGATE)
+16V: C1.2 C3.2 C4.2 C6.2 C8.1 C9.1 C10.1 C11.1 C12.1 C14.1 D1.1 F1.2 H2.2 H2.4 H2.6 H2.8 R2.2 R13.2 R14.2 T1.3(2) T1.4(2) T1.5(2) T1.6(2) U2.3(IN) U3.3(INPUT) U6.6(VCC)
GND: C1.1 C2.2 C3.1 C4.1 C5.1 C6.1 C7.1 C8.2 C9.2 C10.2 C11.2 C12.2 C13.1 C14.2 C15.1 C16.1 C17.1 CN1.1(-) CN4.1 CN6.2 D1.2 D5.2 D6.2 H1.4 H2.1 H2.3 H2.5 H2.7 LED1.1(K) LED2.1(K) LED3.1(K) LED4.1(K) P1.1 P2.1 Q2.3(E) Q3.3(E) R7.1 R9.1 R19.2 R23.1 T1.12 U1.4(-VSS) U2.2(GND) U3.2(GND) U5.2(GND) U6.3(GND) U9.3(OVLO1) U9.5(OVLO2) U9.9(CLAMP) U9.11(CSN) U9.21(EP) U10.1 U11.7(GND)
VBAT: CN1.2(+) CN4.2 CN5.1 SW1.3 SW1.4
CHG_EN: H1.6 R6.2 U11.13(1C)
CHG_FAULT: U9.6(FAULT#)
CHIP: D6.1 Q3.1(G) R10.2
CHIP_IN: H1.1 R5.2 U5.1(1A) U11.1(1A)
SHOOT: D5.1 Q2.1(G) R12.1
SHOOT_IN: H1.3 R4.2 U5.3(2A) U11.2(1B)
VCAP: CN2.2 CN3.2 D2.1 D3.4 D4.4 P1.2 P2.2 R15.2 SW3.1 SW3.2
VFB: C15.2 H1.2 R15.1 R23.2 U1.3(+INA) U9.10(FB)
$1N3552: LED2.2(A) R2.1
$1N3560: R14.1 U9.1(RVTRANS)
$1N3563: R13.1 U9.2(UVLO1)
$1N3564: R18.2 U9.4(UVLO2)
$1N3565: C13.2 R21.1 U9.7(DONE#) U9.8(CHARGE)
$1N3567: LED3.2(A) R8.1
$1N3569: LED4.2(A) R11.2
$1N3573: Q1.4(G) U9.15(HVGATE)
$1N3574: Q1.5(D) Q1.6(D) Q1.7(D) Q1.8(D) R16.2 R17.1 T1.7(1) T1.8(1) T1.9(1) T1.10
$1N3575: Q1.1(S) Q1.2(S) Q1.3(S) U9.12(CSP) U10.2
$1N3576: R17.2 U9.18(RVOUT)
$1N3577: R16.1 U9.20(RDCM)
$1N3579: R19.1 U9.16(RBG)
$1N3581: D2.2 T1.1
$1N3586: CN2.1 D3.1 D3.3 Q2.2(C)
$1N3588: CN3.1 D4.1 D4.3 Q3.2(C)
$1N3590: R3.1 R7.2 U1.2(-INA)
$1N3595: R1.1 U1.1(OUTA)
$1N3596: LED1.2(A) R1.2
$1N3599: R9.2 SW3.3 SW3.4
$1N3603: U5.6(1Y) U6.2(INPUTA)
$1N3604: U5.4(2Y) U6.4(INPUTB)
$1N3608: R10.1 U6.7(OUTPUTA)
$1N3609: R12.2 U6.5(OUTPUTB)
$1N3623: F1.1 SW1.1 SW1.2
$1N3639: R21.2 U11.12(1Y)
$1N11398: CN5.2 CN6.1

Not connected (* = marked no-connect by the designer): CN1 3 4; U1 5(+INB)* 6(-INB)* 7(OUTB)*; U6 1(NC)* 8(NC)*; U9 17(NC)* 19(NC)*; U11 3(2A)* 4(2B)* 5(2C)* 6(2Y)* 8(3Y)* 9(3A)* 10(3B)* 11(3C)*

## Notes on the sheet
- 主供电
- 控制板接口
- 电容电量反馈
- 16V转5V
- 16V转12V
- 手动放电
- IGBT驱动
- 主升压 (FlyBack)
